# Altium project AltiumGuide.PrjPcb
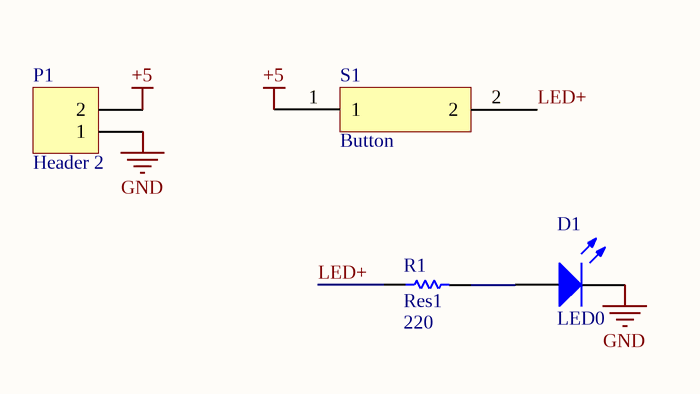
[diagram p0: LEDProject.SchDoc]
1 sheet, 4 parts. Net scope: global (net labels, ports and power ports of the same name join across sheets).
Board file: LEDProject.PcbDoc

## Sheet LEDProject.SchDoc
size A4

### Parts
D1  LED0  [LED-0]
P1  Header 2  [HDR1X2]
R1  Res1  value 220  [C0805]
S1  Button  [c0805]

### Nets
+5: P1.2 S1.1
GND: D1.2(K) P1.1
LED+: R1.1 S1.2
NetD1_1: D1.1(A) R1.2

### Library data of the parts
D1 = LED0: Typical INFRARED GaAs LED; Published: 8-Jun-2000; LatestRevisionDate: 08-Jul-2005; LatestRevisionNote: Mech Layer 1 removed.; PackageReference: LED-0; Publisher: Altium Limited; PackageDescription: LED; 2 Leads
P1 = Header 2: Header, 2-Pin; LatestRevisionDate: 17-Jul-2002; LatestRevisionNote: Re-released for DXP Platform.; Publisher: Altium Limited
R1 = Res1: Resistor; Published: 8-Jun-2000; LatestRevisionDate: 17-Jul-2002; LatestRevisionNote: Re-released for DXP Platform.; PackageReference: AXIAL-0.3; Publisher: Altium Limited; PackageDescription: Axial Device, Thru-Hole; 2 Leads; 0.3 in Pin Spacing